# EAGLE schematic BOOSTXL-EDUMKII (EAGLE 7.2.0)
AUTHOR: Mike Stein; REV: 1.0; TITLE: EDUCATIONAL BOOSTERPACK MK II

## Sheet 1 of 2
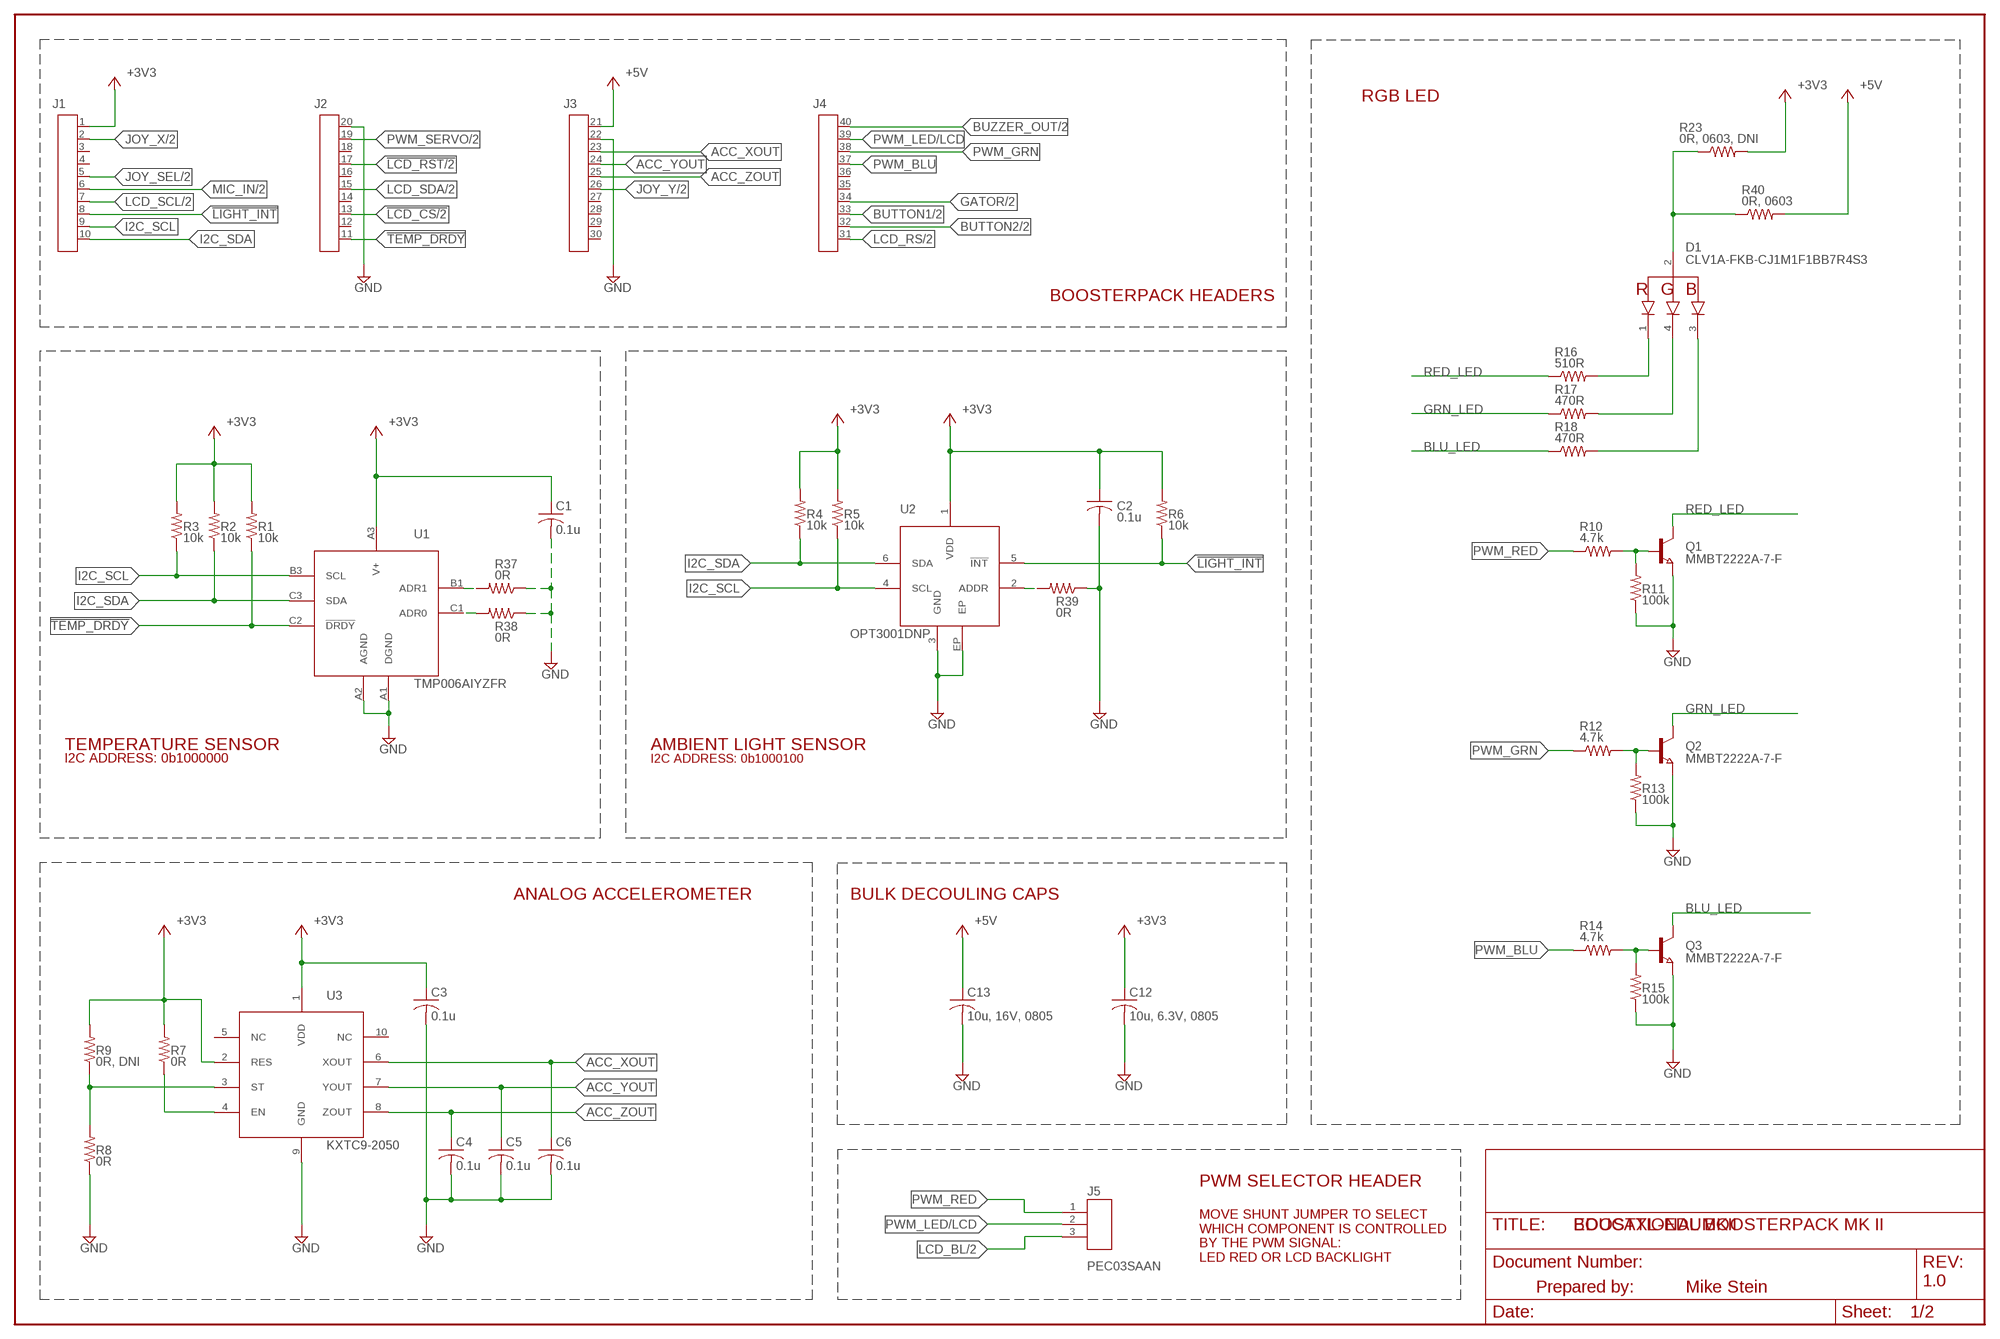
[diagram p0: schematic, sheet 1]

### Parts
C1  0.1u  C-USCM0402  [0402]
C2  0.1u  C-USCM0402  [0402]
C3  0.1u  C-USCM0402  [0402]
C4  0.1u  C-USCM0402  [0402]
C5  0.1u  C-USCM0402  [0402]
C6  0.1u  C-USCM0402  [0402]
C12  10u, 6.3V, 0805  C-USC0805  [C0805]
C13  10u, 16V, 0805  C-USC0805  [C0805]
D1  CLV1A-FKB-CJ1M1F1BB7R4S3  CLV1A-FKB  [CLV1A-FKB]
J1  HEADER1X10  [1X10]
J2  HEADER1X10-J2  [1X10-J2]
J3  HEADER1X10-J3  [1X10-J3]
J4  HEADER1X10-J4  [1X10-J4]
J5  PEC03SAAN  HEADER1X03  [1X03]
Q1  MMBT2222A-7-F  NPN-TRANSISTOR_SOT23  [SOT23]
Q2  MMBT2222A-7-F  NPN-TRANSISTOR_SOT23  [SOT23]
Q3  MMBT2222A-7-F  NPN-TRANSISTOR_SOT23  [SOT23]
R1  10k  R-US_RM0402  [0402]
R2  10k  R-US_RM0402  [0402]
R3  10k  R-US_RM0402  [0402]
R4  10k  R-US_RM0402  [0402]
R5  10k  R-US_RM0402  [0402]
R6  10k  R-US_RM0402  [0402]
R7  0R  R-US_RM0402  [0402]
R8  0R  R-US_RM0402  [0402]
R9  0R, DNI  R-US_RM0402  [0402]
R10  4.7k  R-US_RM0402  [0402]
R11  100k  R-US_RM0402  [0402]
R12  4.7k  R-US_RM0402  [0402]
R13  100k  R-US_RM0402  [0402]
R14  4.7k  R-US_RM0402  [0402]
R15  100k  R-US_RM0402  [0402]
R16  510R  R-US_RM0402  [0402]
R17  470R  R-US_RM0402  [0402]
R18  470R  R-US_RM0402  [0402]
R23  0R, 0603, DNI  R-US_R0603  [R0603]
R37  0R  R-US_RM0402  [0402]
R38  0R  R-US_RM0402  [0402]
R39  0R  R-US_RM0402  [0402]
R40  0R, 0603  R-US_R0603  [R0603]
U1  TMP006AIYZFR  TMP006AIYZF  [YZF_S-XBGA-N8]
U2  OPT3001DNP  [DNP_S-PWSON-N6]
U3  KXTC9-2050  [KXTC9-2050]

### Nets
!LCD_CS: J2.13 ; also sheet 2
!LCD_RST: J2.17 ; also sheet 2
!LIGHT_INT: J1.8 R6.1 U2.5(!INT)
!TEMP_DRDY: J2.11 R1.1 U1.C2(!DRDY)
+3V3 [Power]: C1.1 C2.1 C3.1 C12.1 J1.1 R1.2 R2.2 R3.2 R4.2 R5.2 R6.2 R7.2 R9.2 R23.2 U1.A3(V+) U2.1(VDD) U3.1(VDD) U3.2(RES) ; also sheet 2
+5V [Power]: C13.1 J3.21 R40.2 ; also sheet 2
ACC_XOUT: C6.1 J3.23 U3.6(XOUT)
ACC_YOUT: C5.1 J3.24 U3.7(YOUT)
ACC_ZOUT: C4.1 J3.25 U3.8(ZOUT)
BLU_LED: Q3.3(C) R18.1
BUTTON1: J4.33 ; also sheet 2
BUTTON2: J4.32 ; also sheet 2
BUZZER_OUT: J4.40 ; also sheet 2
GATOR: J4.34 ; also sheet 2
GND [Power]: C1.2 C2.2 C3.2 C4.2 C5.2 C6.2 C12.2 C13.2 J2.20 J3.22 Q1.2(E) Q2.2(E) Q3.2(E) R8.1 R11.1 R13.1 R15.1 R37.1 R38.1 R39.1 U1.A1(DGND) U1.A2(AGND) U2.3(GND) U2.EP U3.9(GND) ; also sheet 2
GRN_LED: Q2.3(C) R17.1
I2C_SCL: J1.9 R3.1 R5.1 U1.B3(SCL) U2.4(SCL)
I2C_SDA: J1.10 R2.1 R4.1 U1.C3(SDA) U2.6(SDA)
JOY_SEL: J1.5 ; also sheet 2
JOY_X: J1.2 ; also sheet 2
JOY_Y: J3.26 ; also sheet 2
LCD_BL: J5.3 ; also sheet 2
LCD_RS: J4.31 ; also sheet 2
LCD_SCL: J1.7 ; also sheet 2
LCD_SDA: J2.15 ; also sheet 2
MIC_IN: J1.6 ; also sheet 2
N$2: R7.1 U3.4(EN)
N$3: R8.2 R9.1 U3.3(ST)
N$5: Q1.1(B) R10.2 R11.2
N$6: Q2.1(B) R12.2 R13.2
N$7: Q3.1(B) R14.2 R15.2
N$16: R37.2 U1.B1(ADR1)
N$17: D1.1(RED) R16.2
N$18: D1.4(GRN) R17.2
N$19: D1.3(BLU) R18.2
N$20: R38.2 U1.C1(ADR0)
N$21: R39.2 U2.2(ADDR)
PWM_BLU: J4.37 R14.1
PWM_GRN: J4.38 R12.1
PWM_LED/LCD: J4.39 J5.2
PWM_RED: J5.1 R10.1
PWM_SERVO: J2.19 ; also sheet 2
RED_LED: Q1.3(C) R16.1
V_RGB: D1.2(CA) R23.1 R40.1
Unconnected: J1.3 J1.4 J2.12 J2.14 J2.16 J2.18 J3.27 J3.28 J3.29 J3.30 J4.35 J4.36 U3.5(NC) U3.10(NC)

### Notes on the sheet
- RGB LED
- BOOSTERPACK HEADERS
- TEMPERATURE SENSOR | AMBIENT LIGHT SENSOR
- I2C ADDRESS: 0b1000000 | I2C ADDRESS: 0b1000100
- ANALOG ACCELEROMETER | BULK DECOULING CAPS
- PWM SELECTOR HEADER
- MOVE SHUNT JUMPER TO SELECT
  WHICH COMPONENT IS CONTROLLED
  BY THE PWM SIGNAL:
  LED RED OR LCD BACKLIGHT
- DEFAULT: J5.1
- Prepared by:

## Sheet 2 of 2
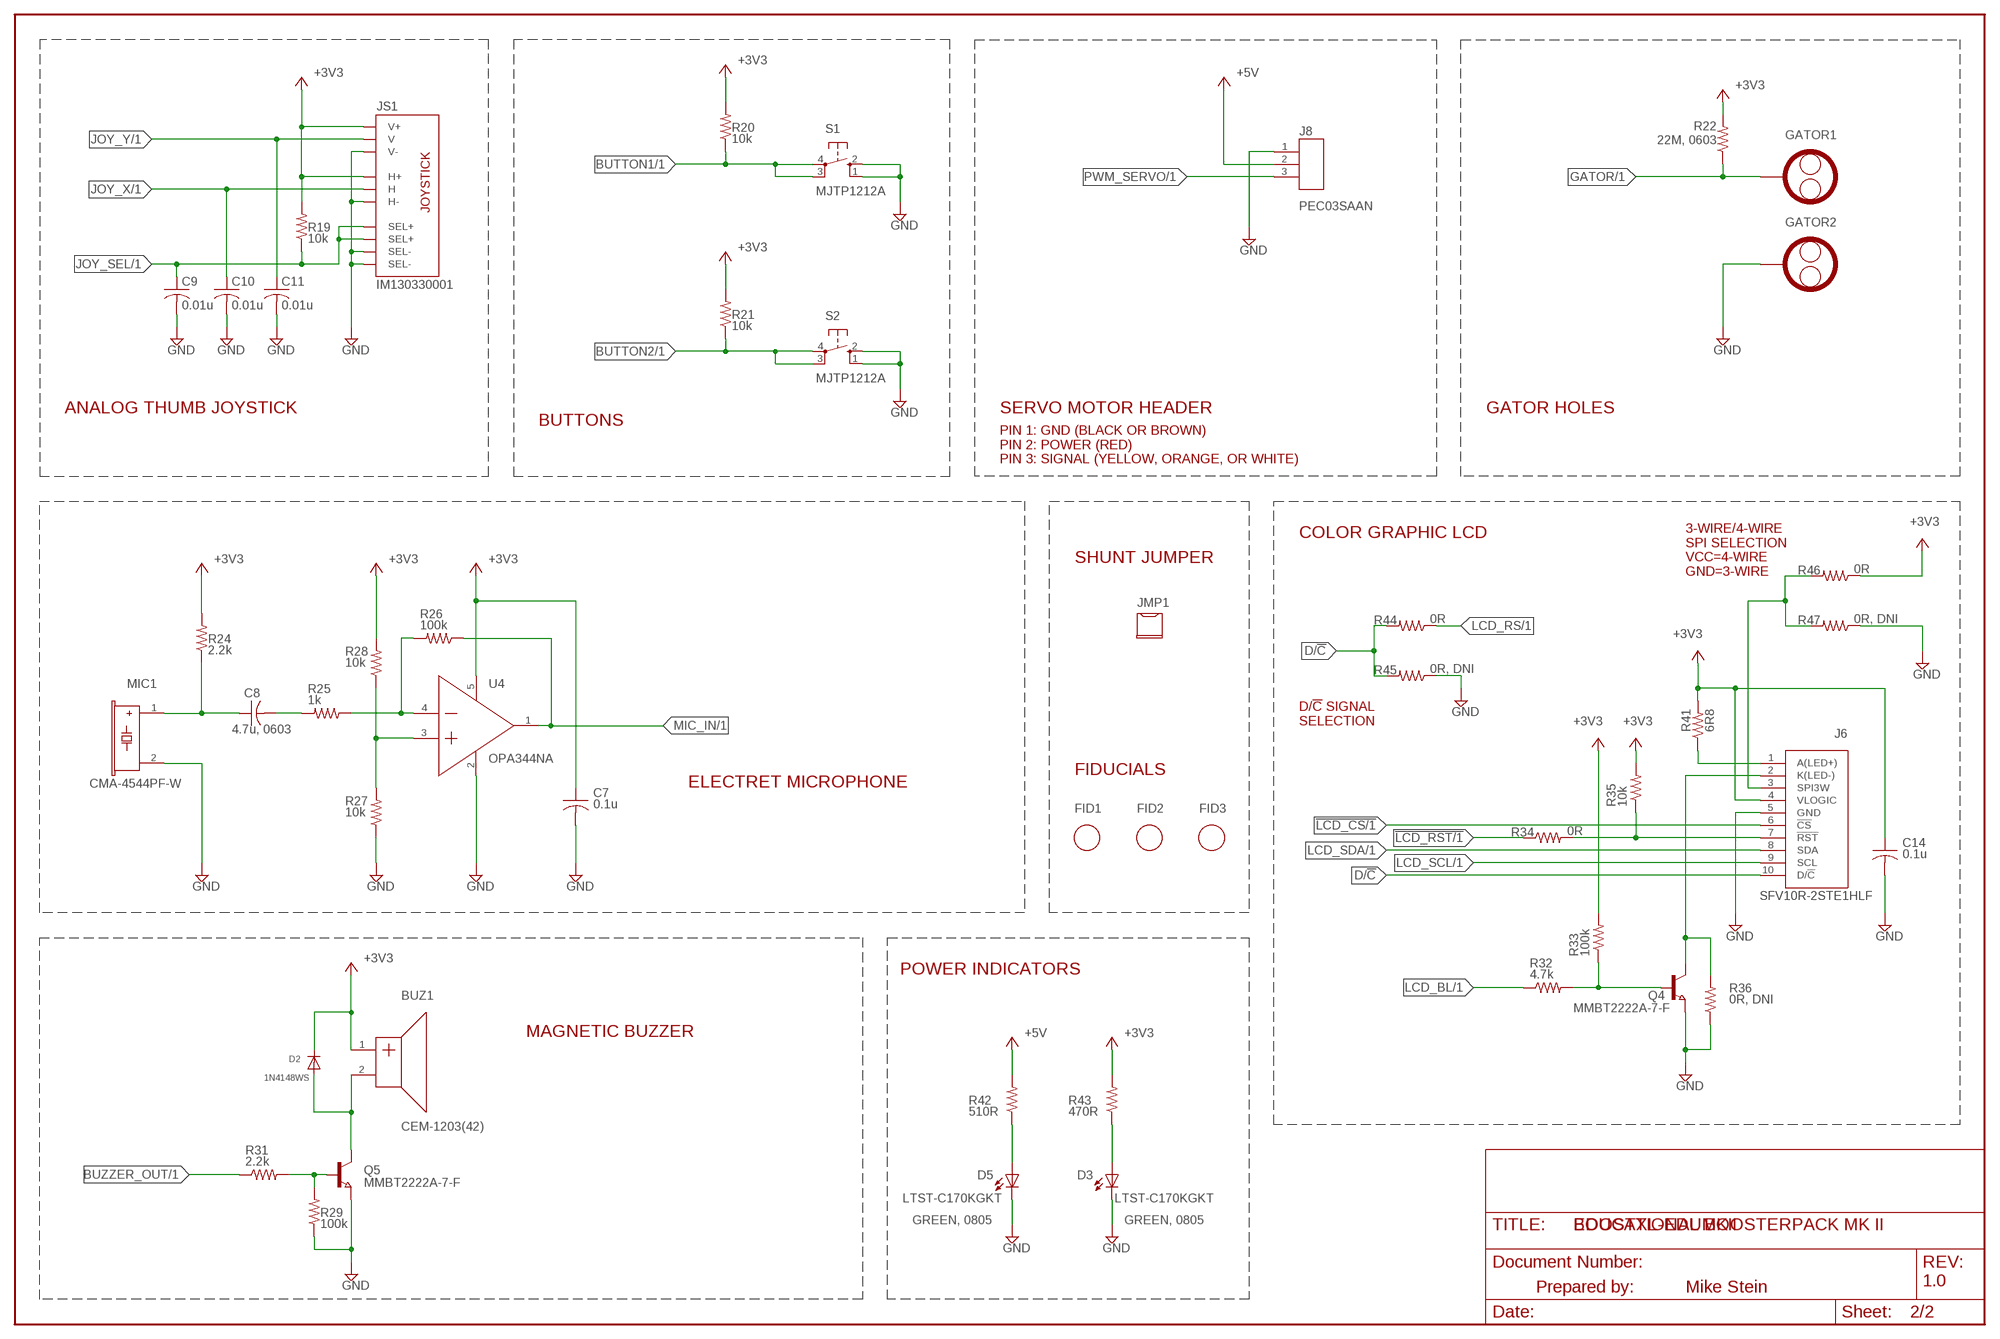
[diagram p1: schematic, sheet 2]

### Parts
BUZ1  CEM-1203(42)  [CEM-1203(42)]
C7  0.1u  C-USCM0402  [0402]
C8  4.7u, 0603  C-USC0603  [C0603]
C9  0.01u  C-USCM0402  [0402]
C10  0.01u  C-USCM0402  [0402]
C11  0.01u  C-USCM0402  [0402]
C14  0.1u  C-USCM0402  [0402]
D2  1N4148WS  DIODE  [SOD-323F]
D3  LTST-C170KGKT  LED  [LED-CHIP0805]
D5  LTST-C170KGKT  LED  [LED-CHIP0805]
FID1  FIDUCIAL  [FIDUCIAL_1MM]
FID2  FIDUCIAL  [FIDUCIAL_1MM]
FID3  FIDUCIAL  [FIDUCIAL_1MM]
GATOR1  GATOR_HOLE  [GATOR-HOLE-3MM]
GATOR2  GATOR_HOLE  [GATOR-HOLE-3MM]
J6  SFV10R-2STE1HLF  [SFV10R-2STE1HLF]
J8  PEC03SAAN  HEADER1X03  [1X03]
JS1  IM130330001  JOYSTICK-SW  [JOYSTICK-SW]
MIC1  CMA-4544PF-W  [CMA-4544PF-W]
Q4  MMBT2222A-7-F  NPN-TRANSISTOR_SOT23  [SOT23]
Q5  MMBT2222A-7-F  NPN-TRANSISTOR_SOT23  [SOT23]
R19  10k  R-US_RM0402  [0402]
R20  10k  R-US_RM0402  [0402]
R21  10k  R-US_RM0402  [0402]
R22  22M, 0603  R-US_R0603  [R0603]
R24  2.2k  R-US_RM0402  [0402]
R25  1k  R-US_RM0402  [0402]
R26  100k  R-US_RM0402  [0402]
R27  10k  R-US_RM0402  [0402]
R28  10k  R-US_RM0402  [0402]
R29  100k  R-US_RM0402  [0402]
R31  2.2k  R-US_RM0402  [0402]
R32  4.7k  R-US_RM0402  [0402]
R33  100k  R-US_RM0402  [0402]
R34  0R  R-US_RM0402  [0402]
R35  10k  R-US_RM0402  [0402]
R36  0R, DNI  R-US_RM0402  [0402]
R41  6R8  R-US_RM0402  [0402]
R42  510R  R-US_RM0402  [0402]
R43  470R  R-US_RM0402  [0402]
R44  0R  R-US_RM0402  [0402]
R45  0R, DNI  R-US_RM0402  [0402]
R46  0R  R-US_RM0402  [0402]
R47  0R, DNI  R-US_RM0402  [0402]
S1  MJTP1212A  SWITCH-MJTP  [TACTILE-MJTP]
S2  MJTP1212A  SWITCH-MJTP  [TACTILE-MJTP]
U4  OPA344NA  [DBV_R-PDSO-G5]

### Nets
!LCD_CS: J6.6(!CS) ; also sheet 1
!LCD_RST: R34.1 ; also sheet 1
+3V3 [Power]: BUZ1.1(SPKR_P) C7.1 C14.1 D2.C J6.4(VLOGIC) JS1.H+ JS1.V+ R19.2 R20.2 R21.2 R22.2 R24.2 R28.2 R33.2 R35.2 R41.2 R43.2 R46.1 U4.5(V+) ; also sheet 1
+5V [Power]: J8.2 R42.2 ; also sheet 1
BUTTON1: R20.1 S1.3(P1) S1.4(P) ; also sheet 1
BUTTON2: R21.1 S2.3(P1) S2.4(P) ; also sheet 1
BUZZER_OUT: R31.1 ; also sheet 1
D/!C: J6.10(D/!C) R44.2 R45.2
GATOR: GATOR1.1@1 R22.1 ; also sheet 1
GND [Power]: C7.2 C9.2 C10.2 C11.2 C14.2 D3.C D5.C GATOR2.1@1 J6.5(GND) J8.1 JS1.H- JS1.SEL-1(SEL-) JS1.SEL-2(SEL-) JS1.V- MIC1.2(NEG) Q4.2(E) Q5.2(E) R27.1 R29.1 R36.1 R45.1 R47.1 S1.1(S1) S1.2(S) S2.1(S1) S2.2(S) U4.2(V-) ; also sheet 1
JOY_SEL: C9.1 JS1.SEL+1(SEL+) JS1.SEL+2(SEL+) R19.1 ; also sheet 1
JOY_X: C10.1 JS1.H ; also sheet 1
JOY_Y: C11.1 JS1.V ; also sheet 1
LCD_BL: R32.1 ; also sheet 1
LCD_RS: R44.1 ; also sheet 1
LCD_SCL: J6.9(SCL) ; also sheet 1
LCD_SDA: J6.8(SDA) ; also sheet 1
MIC_IN: R26.1 U4.1(OUT) ; also sheet 1
N$1: C8.1 MIC1.1(POS) R24.1
N$4: R25.1 R26.2 U4.4(-IN)
N$8: C8.2 R25.2
N$9: J6.1(A(LED+)) R41.1
N$10: R27.2 R28.1 U4.3(+IN)
N$11: Q5.1(B) R29.2 R31.2
N$12: BUZ1.2(SPKR_N) D2.A Q5.3(C)
N$13: J6.2(K(LED-)) Q4.3(C) R36.2
N$15: Q4.1(B) R32.2 R33.1
N$22: J6.3(SPI3W) R46.2 R47.2
N$23: J6.7(!RST) R34.2 R35.1
N$25: D5.A R42.1
N$26: D3.A R43.1
PWM_SERVO: J8.3 ; also sheet 1

### Notes on the sheet
- ANALOG THUMB JOYSTICK | SERVO MOTOR HEADER | GATOR HOLES
- BUTTONS
- PIN 1: GND (BLACK OR BROWN)
  PIN 2: POWER (RED)
  PIN 3: SIGNAL (YELLOW, ORANGE, OR WHITE)
- COLOR GRAPHIC LCD
- SHUNT JUMPER
- 3-WIRE/4-WIRE
  SPI SELECTION
  VCC=4-WIRE
  GND=3-WIRE
- D/!C! SIGNAL
  SELECTION
- FIDUCIALS
- ELECTRET MICROPHONE
- FID1 | FID2 | FID3
- POWER INDICATORS
- MAGNETIC BUZZER
- GREEN, 0805 | GREEN, 0805
- Prepared by:

## Library data of the parts
BUZ1 = circuitco-eagle:CEM-1203(42)
C1-C7 C9-C11 C14 = resistor:C-US: CAPACITOR, American symbol
C8 = adafruit:C-US: CAPACITOR, American symbol
C12 C13 = rcl:C-US: CAPACITOR, American symbol
D1 = circuitco-eagle:CLV1A-FKB: CLV1A-FKB Cree PLCC full-color LEDs offer highintensity light output and a wide viewing angle in an industry-standard package. Designed to work in a wide array of environmental conditions, Cree PLCC full-color LEDs are suited for indoor video screen, decorative lighting and amusement applications.
D2 = circuitco-eagle:DIODE
D3 D5 = circuitco-eagle:LED
FID1-FID3 = adafruit:FIDUCIAL: For use by pick and place machines to calibrate the vision/machine, 1mm By microbuilder.eu
GATOR1 GATOR2 = circuitco-eagle:GATOR_HOLE
J1 = circuitco-eagle:HEADER1X10
J2 = circuitco-eagle:HEADER1X10-J2
J3 = circuitco-eagle:HEADER1X10-J3
J4 = circuitco-eagle:HEADER1X10-J4
J5 J8 = circuitco-eagle:HEADER1X03
J6 = circuitco-eagle:SFV10R-2STE1HLF
JS1 = circuitco-eagle:JOYSTICK-SW: Thumb Joystick Joystick commonly found in PS2 controllers. Two pots and a select switch.
MIC1 = circuitco-eagle:CMA-4544PF-W
Q1-Q5 = semicon-smd-ipc:NPN-TRANSISTOR_: NPN TRANSISTOR
R1-R29 R31-R47 = resistor:R-US_: RESISTOR, American symbol
S1 S2 = circuitco-eagle:SWITCH-MJTP
U1 = circuitco-eagle:TMP006AIYZF: TMP006AIYZF This sensor uses a thermopile to absorb the infrared energy emitted from the object being measured and uses the corresponding change in thermopile voltage to determine the object temperature>/p>
U2 = circuitco-eagle:OPT3001DNP: OPT3001DNP The OPT3001 Ambient Light Sensor is an ideal device for measuring ambient light for adjusting LCD backlight, and other active lighting systems.
U3 = circuitco-eagle:KXTC9-2050: KXTC9-2050 The KXTC9-2050 is a Tri-axis, silicon micromachined accelerometer with a full-scale output range of +/-2g (19.6 m/s/s)
U4 = circuitco-eagle:OPA344NA: OPA344 The OPA344 series rail-to-rail CMOS operational amplifiers are designed for precision, low-power, miniature applications.

## Net classes
0 default: width 0.203 mm, drill 0.381 mm, clearance 0.203 mm
1 Power: width 0.254 mm, drill 0.381 mm, clearance 0.203 mm